# EAGLE design mainboard (EAGLE 7.5.0)
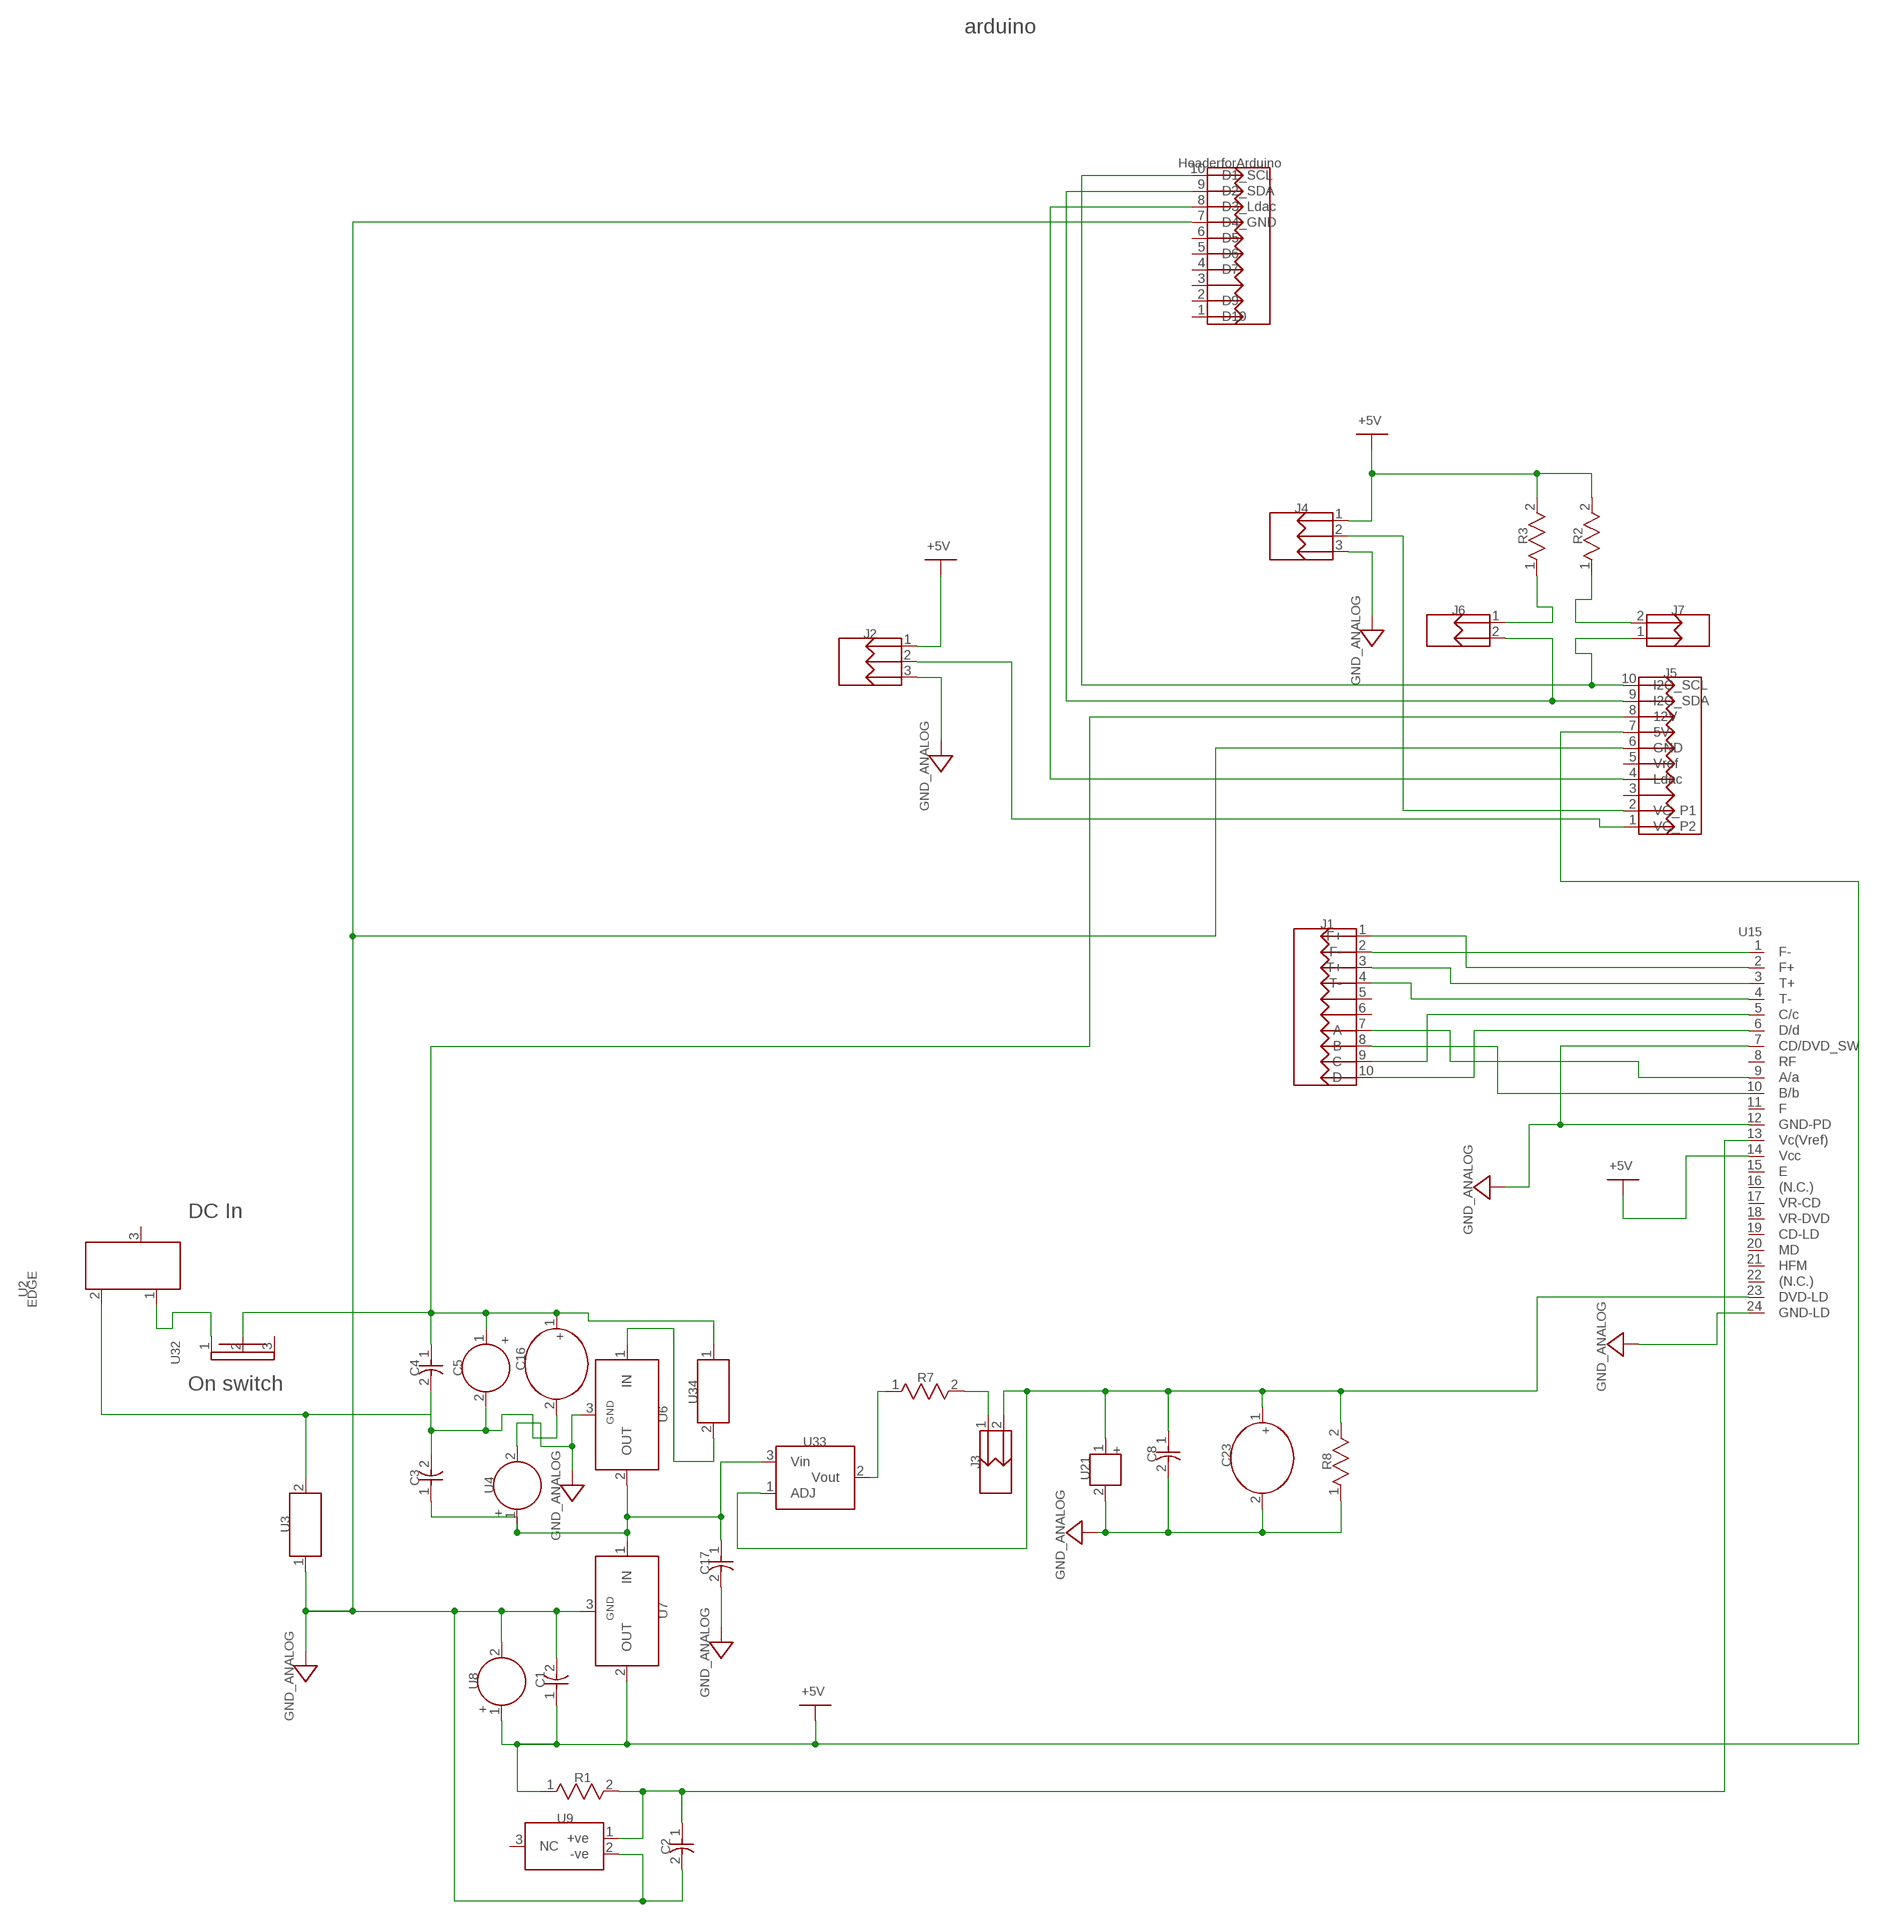
[diagram p0: schematic, sheet 1]

## Parts
C1  1u  CAP_0805  [CAP_0805]
C2  0u1  CAP_0805  [CAP_0805]
C3  1u  CAP_0805  [CAP_0805]
C4  1u  CAP_0805  [CAP_0805]
C5  10UF_CAP  [CAPR-2.5/6.3H11]
C8  0u1  CAP_0805  [CAP_0805]
C16  220UF_CAP  [CAPPR-5/10.5H14]
C17  1u  CAP_0805  [CAP_0805]
C23  220UF_CAP  [CAPPR-5/10.5H14]
HeaderforArduino  1-644456-0  [HDR-1X10T/2.54/25X2]
J1  TVS3V5  [HDR-1X10T/2.54/25X2]
J2  644456-3  [HDR-1X3T/2.54/7X2]
J3  90131-0121  [HDR-2X1T/2.54X2.54/3X5]
J4  644456-3  [HDR-1X3T/2.54/7X2]
J5  1-644456-0_8  [HDR-1X10T/2.54/25X2]
J6  90131-0121  [HDR-2X1T/2.54X2.54/3X5]
J7  90131-0121  [HDR-2X1T/2.54X2.54/3X5]
R1  1k  RES_0805  [RES_0805]
R2  4k7  RES_0805  [RES_0805]
R3  4k7  RES_0805  [RES_0805]
R7  20R  RES_0805  [RES_0805]
R8  500k  RES_0805  [RES_0805]
U2  DCJACK2.1MM  [DCJACK2.1MM]
U3  2A,45ohm  FERRITEBEAD  [RES_1210]
U4  10UF_CAP  [CAPR-2.5/6.3H11]
U6  L7809CV  [TO-220V]
U7  L7805CV  [TO-220V]
U8  10UF_CAP  [CAPR-2.5/6.3H11]
U9  2.048V ref  LM4040  [SOT23]
U15  SF-HD65_CONNECTOR  [24PIN_FLEX_.5MM_PITCH]
U21  TVS3V5_4  [SMB]
U32  SPSWITCH  [SPSWITCH]
U33  LM317T  [TO-220]
U34  2A,45ohm  FERRITEBEAD  [RES_1210]

## Nets
2V1: C2.1 R1.2 U9.1(+ve) U15.13(Vc(Vref))
5V: C1.1 J2.1 J4.1 J5.7(5V) R1.1 R2.2 R3.2 U7.2(OUT) U8.1 U15.14(Vcc) ; supply symbol labelled +5V
9V: C3.1 C17.1 U4.1 U6.2(OUT) U7.1(IN) U33.3(Vin)
GND: C1.2 C2.2 C8.2 C17.2 C23.2 HeaderforArduino.7(D4_GND) J2.3 J4.3 J5.6(GND) R8.1 U3.1 U4.2 U6.3(GND) U7.3(GND) U8.2 U9.2(-ve) U15.7(CD/DVD_SW) U15.12(GND-PD) U15.24(GND-LD) U21.2 ; supply symbol labelled GND_ANALOG
GND_digi: C3.2 C4.2 C5.2 C16.2 U2.2 U3.2
Net_1: C4.1 C5.1 C16.1 J5.8(12V) U32.2 U34.1
Net_4: J1.7(A) U15.9(A/a)
Net_5: J1.8(B) U15.10(B/b)
Net_6: J1.9(C) U15.5(C/c)
Net_7: J1.10(D) U15.6(D/d)
Net_8: J1.2(F-) U15.1(F-)
Net_9: J1.1(F+) U15.2(F+)
Net_10: J1.3(T+) U15.3(T+)
Net_11: J1.4(T-) U15.4(T-)
Net_16: J3.1 R7.2
Net_17: R7.1 U33.2(Vout)
Net_18: C8.1 C23.1 J3.2 R8.2 U15.23(DVD-LD) U21.1 U33.1(ADJ)
Net_19: HeaderforArduino.10(D1_SCL) J5.10(I2C_SCL) J7.1
Net_20: HeaderforArduino.9(D2_SDA) J5.9(I2C_SDA) J6.2
Net_21: HeaderforArduino.8(D3_Ldac) J5.4(Ldac)
Net_22: J4.2 J5.2(VC_P1)
Net_23: J2.2 J5.1(VC_P2)
Net_24: J6.1 R3.1
Net_25: J7.2 R2.1
Net_65: U2.1 U32.1
Net_72: U6.1(IN) U34.2
Unconnected: HeaderforArduino.1(D10) HeaderforArduino.2(D9) HeaderforArduino.3(D8) HeaderforArduino.4(D7) HeaderforArduino.5(D6) HeaderforArduino.6(D5) J1.5 J1.6 J5.3 J5.5(Vref) U2.3 U9.3(NC) U15.8(RF) U15.11(F) U15.15(E) U15.16((N.C.)) U15.17(VR-CD) U15.18(VR-DVD) U15.19(CD-LD) U15.20(MD) U15.21(HFM) U15.22((N.C.)) U32.3

## Notes on the sheet
- arduino
- HeaderforArduino
- +5V
- J4
- R3 | R2
- +5V
- J6 | J7
- J2
- J5
- GND_ANALOG
- GND_ANALOG
- J1
- U15
- +5V
- DC In
- GND_ANALOG
- U2
- EDGE
- +
- +
- U32
- C16
- On switch | C4 | C5
- R7
- GND_ANALOG
- GND
- U34
- U6
- +
- U33 | +
- C8
- J3 | C23 | R8
- U21
- C3
- U4
- +
- U3
- GND_ANALOG
- C17
- GND_ANALOG
- GND
- U7
- U8 | C1
- GND_ANALOG | +5V
- +
- GND_ANALOG
- R1
- U9
- C2

## Library data of the parts
C1 C3 C4 C17 = common:CAP_0805
C2 C8 = common:CAP_0805; VALUE: 1u
C5 U4 U8 = common:10UF_CAP
C16 C23 = common:220UF_CAP
HeaderforArduino = common:1-644456-0; DATASHEET: http://datasheets.diptrace.com\con_headers\ENG_CD_644456_D2.pdf; MANUFACTURER: TE Connectivity
J1 = common:TVS3V5; DATASHEET: http://datasheets.diptrace.com\con_headers\ENG_CD_644456_D2.pdf; MANUFACTURER: TE Connectivity
J2 J4 = common:644456-3; DATASHEET: http://datasheets.diptrace.com/con_headers/ENG_CD_644456_D2.pdf; MANUFACTURER: TE Connectivity
J3 J6 J7 = common:90131-0121; DATASHEET: http://datasheets.diptrace.com\con_headers\901310126_sd.pdf; MANUFACTURER: Molex
J5 = common:1-644456-0_8; DATASHEET: http://datasheets.diptrace.com\con_headers\ENG_CD_644456_D2.pdf; MANUFACTURER: TE Connectivity
R1 = common:RES_0805
R2 R3 R7 R8 = common:RES_0805; VALUE: 1k
U2 = common:DCJACK2.1MM
U3 U34 = common:FERRITEBEAD
U6 = common:L7809CV; DATASHEET: http://datasheets.diptrace.com\st_micro\CD00000444.pdf; MANUFACTURER: ST Microelectronics
U7 = common:L7805CV; DATASHEET: http://datasheets.diptrace.com\st_micro\CD00000444.pdf; MANUFACTURER: ST Microelectronics
U9 = common:LM4040
U15 = common:SF-HD65_CONNECTOR
U21 = common:TVS3V5_4
U32 = common:SPSWITCH
U33 = common:LM317T; DATASHEET: http://datasheets.diptrace.com\linear\LT117A_317A_LM117_317.pdf; MANUFACTURER: Linear

## Board
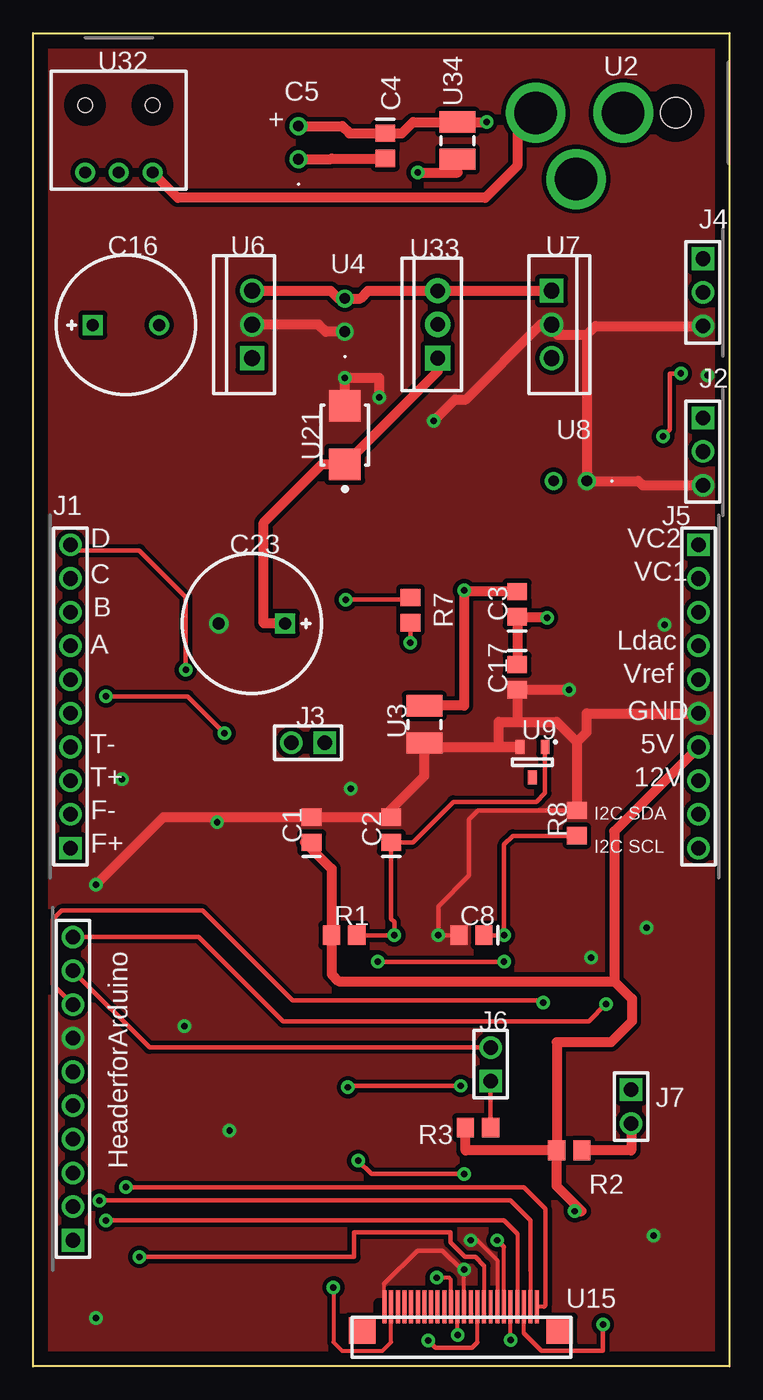
[diagram p1: board, top side]
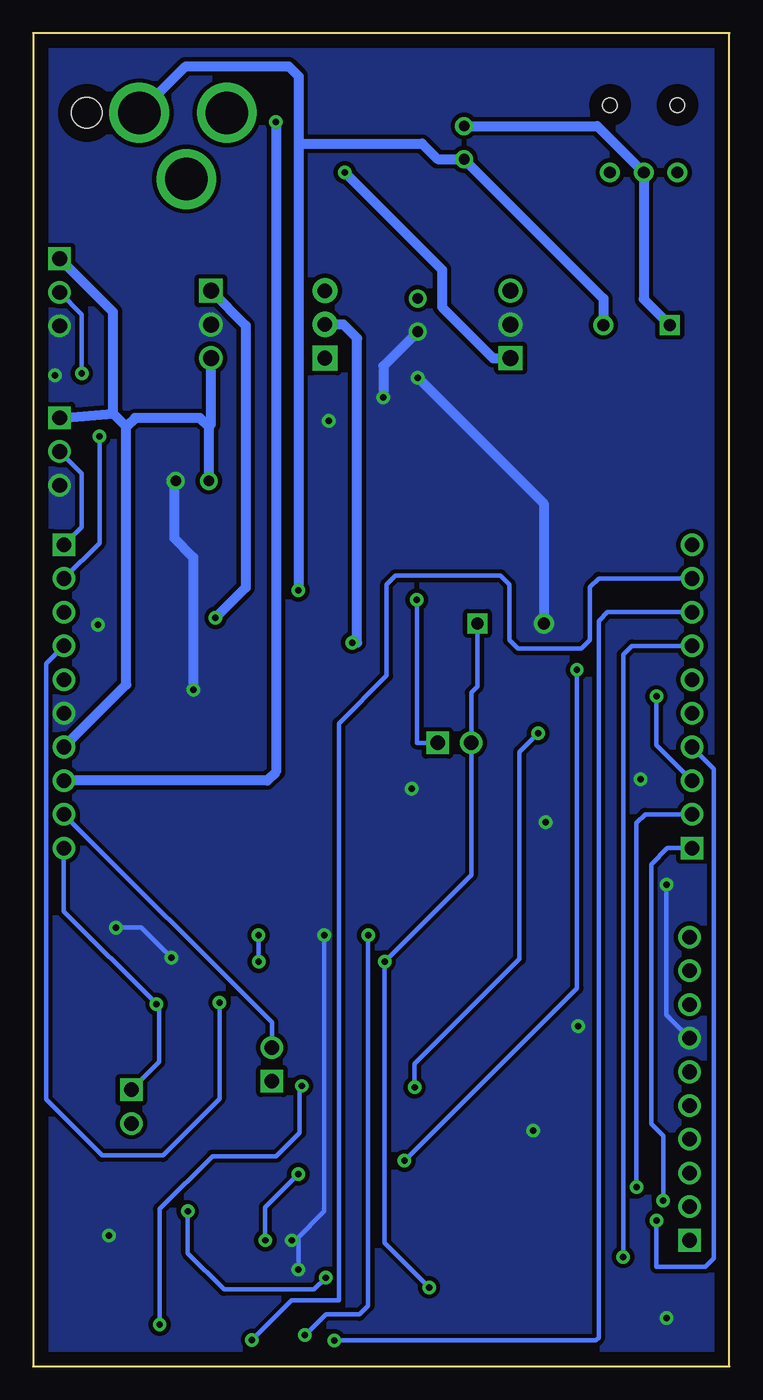
[diagram p2: board, bottom side, seen from below]

Size 52.5 x 100.5 mm. Coordinates in mm from the lower left corner, seen from the top.
Outline: 0,0 0,100.5 52.5,100.5 52.5,0 0,0
Copper layers (1*16): Top 0.035mm / dielectric 1.5mm / Bottom 0.035mm
Design rules "default *": minimum track width 10mil, minimum drill 0.61mm, track to track 8mil, track to pad 8mil, pad to pad 8mil, via to via 8mil, smd to smd 8mil, copper to edge 40mil, drill to drill 8mil, minimum pad ring 0mil, minimum via ring 8mil, stop-mask expansion 2mil, vias tented up to drill 19mil, thermal gap 10mil
tRestrict: 4 lines

### Footprints (pad centres in the part's own frame; a part is rotated, then mirrored left to right if it is on the bottom)
CAP_0805 = smd 1.3 x 1.5: 1 -0.95,0; 2 0.95,0
CAP_0805_C4 = smd 1.3 x 1.5: 1 -0.95,0; 2 0.95,0
CAPR-2.5/6.3h11 = drill 0.8 pad 1.35: 1 -1.25,0; 2 1.25,0
CAP_0805_C8 = smd 1.3 x 1.5: 1 -0.95,0; 2 0.95,0
CAPPR-5/10.5h14 = drill 0.9 pad 1.5 square: 1 -2.5,0 | drill 0.9 pad 1.5: 2 2.5,0
CAPPR-5/10.5h14_C23 = drill 0.9 pad 1.5 square: 1 -2.5,0 | drill 0.9 pad 1.5: 2 2.5,0
HDR-1x10T/2.54/25x2_HeaderforArduino = drill 1.1 pad 1.7 square: 1 -11.43,0 | drill 1.1 pad 1.7: 2 -8.89,0; 3 -6.35,0; 4 -3.81,0; 5 -1.27,0; 6 1.27,0; 7 3.81,0; 8 6.35,0; 9 8.89,0; 10 11.43,0
HDR-1x10T/2.54/25x2 = drill 1.1 pad 1.7 square: 1 -11.43,0 | drill 1.1 pad 1.7: 2 -8.89,0; 3 -6.35,0; 4 -3.81,0; 5 -1.27,0; 6 1.27,0; 7 3.81,0; 8 6.35,0; 9 8.89,0; 10 11.43,0
HDR-1x3T/2.54/7x2 = drill 1.1 pad 1.7 square: 1 -2.54,0 | drill 1.1 pad 1.7: 2 0,0; 3 2.54,0
HDR-2x1T/2.54x2.54/3x5 = drill 1.1 pad 1.7 square: 1 0,-1.27 | drill 1.1 pad 1.7: 2 0,1.27
HDR-1x10T/2.54/25x2_J5 = drill 1.1 pad 1.7 square: 1 -11.43,0 | drill 1.1 pad 1.7: 2 -8.89,0; 3 -6.35,0; 4 -3.81,0; 5 -1.27,0; 6 1.27,0; 7 3.81,0; 8 6.35,0; 9 8.89,0; 10 11.43,0
HDR-2x1T/2.54x2.54/3x5_J6 = drill 1.1 pad 1.7 square: 1 0,-1.27 | drill 1.1 pad 1.7: 2 0,1.27
HDR-2x1T/2.54x2.54/3x5_J7 = drill 1.1 pad 1.7 square: 1 0,-1.27 | drill 1.1 pad 1.7: 2 0,1.27
RES_0805 = smd 1.3 x 1.5: 1 -0.95,0; 2 0.95,0
RES_0805_R2 = smd 1.3 x 1.5: 1 -0.95,0; 2 0.95,0
RES_0805_R3 = smd 1.3 x 1.5: 1 -0.95,0; 2 0.95,0
RES_0805_R7 = smd 1.3 x 1.5: 1 -0.95,0; 2 0.95,0
RES_0805_R8 = smd 1.3 x 1.5: 1 -0.95,0; 2 0.95,0
DCJack2.1mm = drill 3.2 pad 4.5: 1 14.5,0; 2 7.9,0; 3 11.45,5 | hole 2.3: 3.95,0
RES_1210 = smd 1.6 x 2.7: 1 -1.4,0; 2 1.4,0
TO-220V = drill 1.2 pad 1.8 square: 1 -2.54,0 | drill 1.2 pad 1.8: 2 2.54,0; 3 0,0
TO-220V_U7 = drill 1.2 pad 1.8 square: 1 -2.54,0 | drill 1.2 pad 1.8: 2 2.54,0; 3 0,0
CAPR-2.5/6.3h11_U8 = drill 0.8 pad 1.35: 1 -1.25,0; 2 1.25,0
SOT23 = smd 1.05 x 0.65: 1 -1.15,0.95; 2 -1.15,-0.95; 3 1.15,0
24Pin_Flex_.5mm_Pitch = smd 0.3 x 2.5: 1 -2.54,3.81; 2 -3.04,3.81; 3 -3.54,3.81; 4 -4.04,3.81; 5 -4.54,3.81; 6 -5.04,3.81; 7 -5.54,3.81; 8 -6.04,3.81; 9 -6.54,3.81; 10 -7.04,3.81; 11 -7.54,3.81; 12 -8.04,3.81; 13 -8.54,3.81; 14 -9.04,3.81; 15 -9.54,3.81; 16 -10.04,3.81; 17 -10.54,3.81; 18 -11.04,3.81; 19 -11.54,3.81; 20 -12.04,3.81; 21 -12.54,3.81; 22 -13.04,3.81; 23 -13.54,3.81; 24 -14.04,3.81 | smd 2 x 2: 25 -0.84,2.01; 26 -15.74,2.01
SMB = smd 2.4 x 2.4: 1 -2.2,0; 2 2.2,0
SPswitch = drill 0.9 pad 1.5: 1 0,0; 2 2.54,0; 3 5.08,0 | hole 1.1: 0,-5.08; 5.08,-5.08
TO-220 = drill 1.1 pad 1.9 square: 1 -2.54,0 | drill 1.1 pad 1.9: 2 0,0; 3 2.54,0
RES_1210_U34 = smd 1.6 x 2.7: 1 -1.4,0; 2 1.4,0

### Placement (x,y rotation side)
C1  21,40.45 90 top
C2  27,40.45 90 top
C3  36.5,57.45 90 top
C4  1u  [CAP_0805_C4]  26.55,92 270 top
C5  10UF CAP  [CAPR-2.5/6.3h11]  20,92.25 270 top
C8  0u1  [CAP_0805_C8]  33.05,32.5 180 top
C16  220UF CAP  [CAPPR-5/10.5h14]  7,78.5 0 top
C17  1u  [CAP_0805_C8]  36.5,51.95 270 top
C23  220UF CAP  [CAPPR-5/10.5h14_C23]  16.5,56 180 top
HeaderforArduino  1-644456-0  [HDR-1x10T/2.54/25x2_HeaderforArduino]  3,20.93 90 top
J1  TVS3V5  [HDR-1x10T/2.54/25x2]  2.82,50.5 90 top
J2  644456-3  [HDR-1x3T/2.54/7x2]  50.5,68.96 270 top
J3  90131-0121  [HDR-2x1T/2.54x2.54/3x5]  20.73,47 90 top
J4  644456-3  [HDR-1x3T/2.54/7x2]  50.5,80.96 270 top
J5  1-644456-0  [HDR-1x10T/2.54/25x2_J5]  50.18,50.5 270 top
J6  90131-0121  [HDR-2x1T/2.54x2.54/3x5_J6]  34.5,22.77 0 top
J7  90131-0121  [HDR-2x1T/2.54x2.54/3x5_J7]  45.1,19.58 180 top
R1  23.45,32.5 0 top
R2  4k7  [RES_0805_R2]  40.42,16.27 180 top
R3  4k7  [RES_0805_R3]  33.55,18 180 top
R7  20R  [RES_0805_R7]  28.45,57 90 top
R8  500k  [RES_0805_R8]  41,40.95 270 top
U2  DCJACK2.1MM  [DCJack2.1mm]  52.4,94.5 180 top
U3  29.5,48.4 90 top
U4  10UF CAP  [CAPR-2.5/6.3h11]  23.5,79.25 270 top
U6  16.5,78.54 90 top
U7  L7805CV  [TO-220V_U7]  39.1,78.54 270 top
U8  10UF CAP  [CAPR-2.5/6.3h11_U8]  40.5,66.75 0 top
U9  37.65,45.55 270 top
U15  SF-HD65 CONNECTOR  [24Pin_Flex_.5mm_Pitch]  40.54,0.69 0 top
U21  TVS3V5  [SMB]  23.5,70.2 90 top
U32  SPSWITCH  [SPswitch]  9,90 180 top
U33  30.5,78.54 90 top
U34  2A,45ohm  [RES_1210_U34]  32,92.4 270 top

### Tracks (layer width: path | path; a pad name or v marks a point on that pad's centre or on a via)
2V1  (via drill 0.49 pad 1.02)
  Top 0.29: v32,2.35 U15.13
  Top 0.33: R1.2 v27.23,32.5 27.23,33.5 27,33.74 C2.1 28.63,39.5 31.69,42.56 37.94,42.56 38.6,43.22 U9.1
  Bottom 0.33: v27.23,32.5 27.23,4.58 27.89,3.92 30.43,3.92 v32,2.35
5V  (via drill 0.49 pad 1.02)
  Top 0.29: U15.14 31.5,6.53 31.36,6.68 v30.43,6.68
  Top 0.33: C1.1 20.5,39.5
  Top 0.75: J5.7 43.83,40.34 43.83,29.03 | 43.83,29.03 45.15,27.71 45.15,26 43.57,24.43 39.47,24.43 R2.2 | 20.5,39.5 22.5,37.5 R1.1 22.5,29.57 23.04,29.03 43.83,29.03 | R2.2 | R2.2 32.6,16.27 R3.2 | v40.84,11.69 41.37,11.69 39.47,13.59 R2.2
  Bottom 0.33: v30.43,6.68 31.31,5.79 38.1,5.79 40.84,8.53 v40.84,11.69
  Bottom 0.75: J5.7 45.49,51.38 45.49,70.84 | 45.49,70.84 46.47,71.83 | 46.47,71.83 46.47,79.47 J4.1 | U8.1 39.25,70.84 | 39.25,70.84 39.1,70.99 U7.2 | J2.1 46.47,71.83 | 39.25,70.84 39.91,71.5 44.83,71.5 45.49,70.84
9V  (via drill 0.49 pad 1.02)
  Top 0.75: U6.2 22.44,81.08 23.02,80.5 U4.1 24.67,80.5 25.25,81.08 U33.3 33.73,81.08 | v38.75,56.43 36.5,56.43 C3.1 C17.1 | 33.73,81.08 | 33.73,81.08 U7.1
  Bottom 0.75: U7.1 36.48,78.47 36.48,58.7 v38.75,56.43
GND  (via drill 0.49 pad 1.02)
  Top 0.25: 26.46,6.22 26.46,4.5 U15.24
  Top 0.29: 33.5,9.5 35,8 U15.7 | U15.12 v32.5,7.3
  Top 0.33: v32.5,7.3 32.29,7.3 30.86,8.73 28.97,8.73 26.46,6.22 | C8.2 v30.55,32.5 30.55,34.69 32.87,37.01 32.87,41.24 33.53,41.9 R8.1 | v33,9.5 33.5,9.5
  Top 0.75: v4.74,36.32 9.82,41.4 13.87,41.4 | 13.87,41.4 C1.2 C2.2 26.4,41.4 29.5,44.5 U3.1 29.5,46.7 U9.2 35.11,46.7 35.11,48.58 36.5,48.58 | v40.42,51 C17.2 36.5,48.58 | U4.2 22.07,78 21.54,78.54 U6.3 | U21.2 v23.5,74.53 26.08,74.53 v26.08,73.05 26.08,72.89 | 41.75,77.76 39.56,77.76 39.1,78.23 U7.3 38.26,78.54 32.62,72.89 31.82,72.89 v30.21,71.28 | 41.75,77.76 U8.2 45.61,66.75 45.94,66.42 J2.3 | 36.5,48.58 39.48,48.58 41,47.06 | 41,47.06 R8.1 | 41,47.06 41.75,47.81 41.75,49.23 J5.6 | 41.75,77.76 42.41,78.42 J4.3 | v13.87,41 13.87,41.4
  Bottom 0.33: v30.55,32.5 30.55,11.69 32.69,9.55 32.5,9.55 v32.5,7.3 32.5,9.5 v33,9.5 | v4.74,36.32 4.74,26.48 HeaderforArduino.7 | v42.06,30.8 44.34,33.08 v46.27,33.08
  Bottom 0.75: v23.5,74.53 14,65.03 C23.2 | U8.2 41.86,66.75 41.86,62.42 40.42,60.98 v40.42,51 | U4.2 26.08,75.42 v26.08,73.05
  other vias: 46.8,9.86 14.81,17.77 23.94,43.54 47.63,55.89 4.73,3.64 50.85,74.7 6.69,44.26 11.42,25.64
  pour Top (isolate 0.33, no thermals): 0.98,0.98 0.98,99.52 51.52,99.52 51.52,0.98
  pour Bottom (isolate 0.33, no thermals): 0.98,0.98 0.98,99.52 51.52,99.52 51.52,0.98
GND_digi  (via drill 0.49 pad 1.02)
  Top 0.75: C3.2 32.5,58.4 v32.5,58.5 32.5,49.8 U3.2 | C5.2 22.46,91 22.52,91.05 C4.2
  Bottom 0.75: U2.2 41,98 33.24,98 32.48,97.25 32.48,92.17 | 32.48,92.17 23.17,92.17 22,91 C5.2 9.5,80.5 C16.2 | 32.48,92.17 v32.5,58.5
Net_1  (via drill 0.49 pad 1.02)
  Top 0.75: C5.1 23.3,93.5 23.85,92.95 C4.1 27.8,92.95 28.64,93.8 U34.1 v34.19,93.8
  Bottom 0.75: C5.1 9.96,93.5 U32.2 6.46,80.46 C16.1 | v34.19,93.8 34.19,44.81 34.85,44.15 J5.8
Net_4  (via drill 0.49 pad 1.02)
  Top 0.29: 34,7.59 U15.9
  Top 0.33: v8.01,8.25 24.21,8.25 24.21,10.11 31.46,10.11 31.46,9.36 32.57,8.25 33.34,8.25 34,7.59
  Bottom 0.33: v8.01,8.25 8.01,53.65 7.35,54.31 J1.7
Net_5  (via drill 0.49 pad 1.02)
  Top 0.29: 33.5,1.82 U15.10
  Top 0.33: v29.79,1.96 30.33,1.41 33.09,1.41 33.5,1.82
  Bottom 0.33: v29.79,1.96 10.06,1.96 9.85,2.17 9.85,56.19 9.19,56.85 J1.8
Net_6  (via drill 0.49 pad 1.02)
  Top 0.29: v36,2 U15.5
  Bottom 0.33: v36,2 33.03,4.97 29.45,4.97 29.45,48.46 25.85,52.07 25.85,58.95 25.19,59.61 17.25,59.61 16.59,58.95 16.59,54.76 15.93,54.09 11.17,54.09 10.51,54.76 10.51,58.73 9.85,59.39 J1.9
Net_7  (via drill 0.49 pad 1.02)
  Top 0.29: U15.6 35.5,9
  Top 0.33: 35.5,9 v35,9.5 | J1.10 3.25,61.5 8,61.5 11.5,58 v11.5,52.5 | v24.5,15.5 25.5,14.5 v32.5,14.5
  Bottom 0.33: v24.5,15.5 11.5,28.5 v11.5,52.5 | v32.5,14.5 35,12 v35,9.5
Net_8  (via drill 0.49 pad 1.02)
  Top 0.29: 38.5,4.5 U15.1
  Top 0.33: v7,13.5 37,13.5 38.62,11.88 38.62,4.62 38.5,4.5
  Bottom 0.33: v7,13.5 7,40.96 6.35,41.61 J1.2
Net_9  (via drill 0.49 pad 1.02)
  Top 0.29: 37.5,7.21 U15.2
  Top 0.33: v5,12.5 36,12.5 37.5,11 37.5,7.21
  Bottom 0.33: v5,12.5 5,17.38 5.9,18.29 5.9,37.85 4.69,39.07 J1.1
Net_10  (via drill 0.49 pad 1.02)
  Top 0.29: 37,2.5 U15.3
  Top 0.33: v14.42,47.73 11.65,50.5 v5.5,50.5 | v23.74,21.03 23.85,21.14 v32.25,21.14 | v42.96,3.15 42.96,1.16 38.34,1.16 37,2.5
  Bottom 0.33: v5.5,50.5 5.5,46.83 J1.3 | v14.42,47.73 15.83,46.32 15.83,30.71 23.74,22.8 v23.74,21.03 | v32.25,21.14 32.41,20.98 32.41,17.61 34.18,15.84 38.98,15.84 42.96,11.87 v42.96,3.15
Net_11  (via drill 0.49 pad 1.02)
  Top 0.29: 36.5,10 U15.4
  Top 0.33: v5.5,11 35.5,11 36.5,10
  Bottom 0.33: v5.5,11 5.5,7.5 1.82,7.5 1.16,8.16 1.16,45.03 J1.4
Net_16  (via drill 0.49 pad 1.02)
  Top 0.33: v23.57,57.79 28.45,57.79 R7.2
  Bottom 0.33: v23.57,57.79 23.57,47 J3.1
Net_17  (via drill 0.49 pad 1.02)
  Top 0.33: v28.45,54.56 R7.1
  Bottom 0.75: v28.45,54.56 28.06,54.56 28.06,77.49 29.11,78.54 U33.2
Net_18  (via drill 0.49 pad 1.02)
  Top 0.29: v22.64,5.95 22.64,1.82 23.3,1.16 26.34,1.16 27,1.82 U15.23
  Top 0.33: C8.1 v35.5,32.5 35.5,39.34 36.16,40 R8.2 | v26,30.5 v35.5,30.5 | v35.5,30.5 | 30.5,75 U33.1
  Top 0.75: C23.1 17.39,56 17.39,63.59 21.8,68 U21.1 30.5,75
  Bottom 0.33: C23.1 19,51.24 19.46,50.78 J3.2 19.46,37.04 v26,30.5 26,9.31 v22.64,5.95 | v35.5,32.5 v35.5,30.5
Net_19  (via drill 0.49 pad 1.02)
  Top 0.33: v43.19,27.3 41.89,26 18.83,26 12.47,32.36 HeaderforArduino.10
  Bottom 0.33: J7.1 43,22.95 43,27.3 v43.19,27.3 50.18,34.29 J5.10
Net_20
  Top 0.33: J6.2 8.78,24.04 HeaderforArduino.9
  Bottom 0.33: J6.2 34.5,25.93 J5.9
Net_21  (via drill 0.49 pad 1.02)
  Top 0.33: v38.44,27.43 38.44,27.6 19.56,27.6 12.79,34.37 2.13,34.37 1.48,33.7 1.48,28.8 HeaderforArduino.8
  Bottom 0.33: v38.44,27.43 38.44,20.17 42.71,15.9 47.31,15.9 51.52,20.11 51.52,52.97 J5.4
Net_22  (via drill 0.49 pad 1.02)
  Top 0.33: v47.49,70.09 48,70.6 48,74.85 v48.84,74.85
  Bottom 0.33: v48.84,74.85 48.84,79.3 J4.2 | v47.49,70.09 47.49,62.08 J5.2
Net_23
  Bottom 0.33: J5.1 48.84,63.27 48.84,67.3 J2.2
Net_24
  Top 0.33: J6.1 R3.1
Net_25
  Top 0.75: J7.2 45.1,16.27 R2.1
Net_65
  Top 0.75: U2.1 36.5,94.5 36.5,90.5 34.09,88.09 10.9,88.09 U32.1
Net_72  (via drill 0.49 pad 1.02)
  Top 0.75: v29,90 32,90 U34.2
  Bottom 0.75: v29,90 21.67,82.67 21.67,79.86 17.82,76 U6.1

### Text on the board
tPlace: U32 | U2 | C5 | U34 | + | C4 | J4 | C16 | U6 | U33 | U7 | U4 | J2 | U8 | U21 | J1 | D | VC2 | J5 | C23 | C | VC1 | B | C3 | A | R7 | Ldac | Vref | C17 | GND | J3 | T- | U3 | U9 | 5V | T+ | 12V | F- | I2C SDA | F+ | C1 | C2 | R8 | I2C SCL | R1 | C8 | J6 | J7 | R3 | HeaderforArduino | R2 | U15